# Altium schematic sheet project_buran.SchDoc
size A2; Author: A. Nikitin; Time: Project Buran Main Sheet
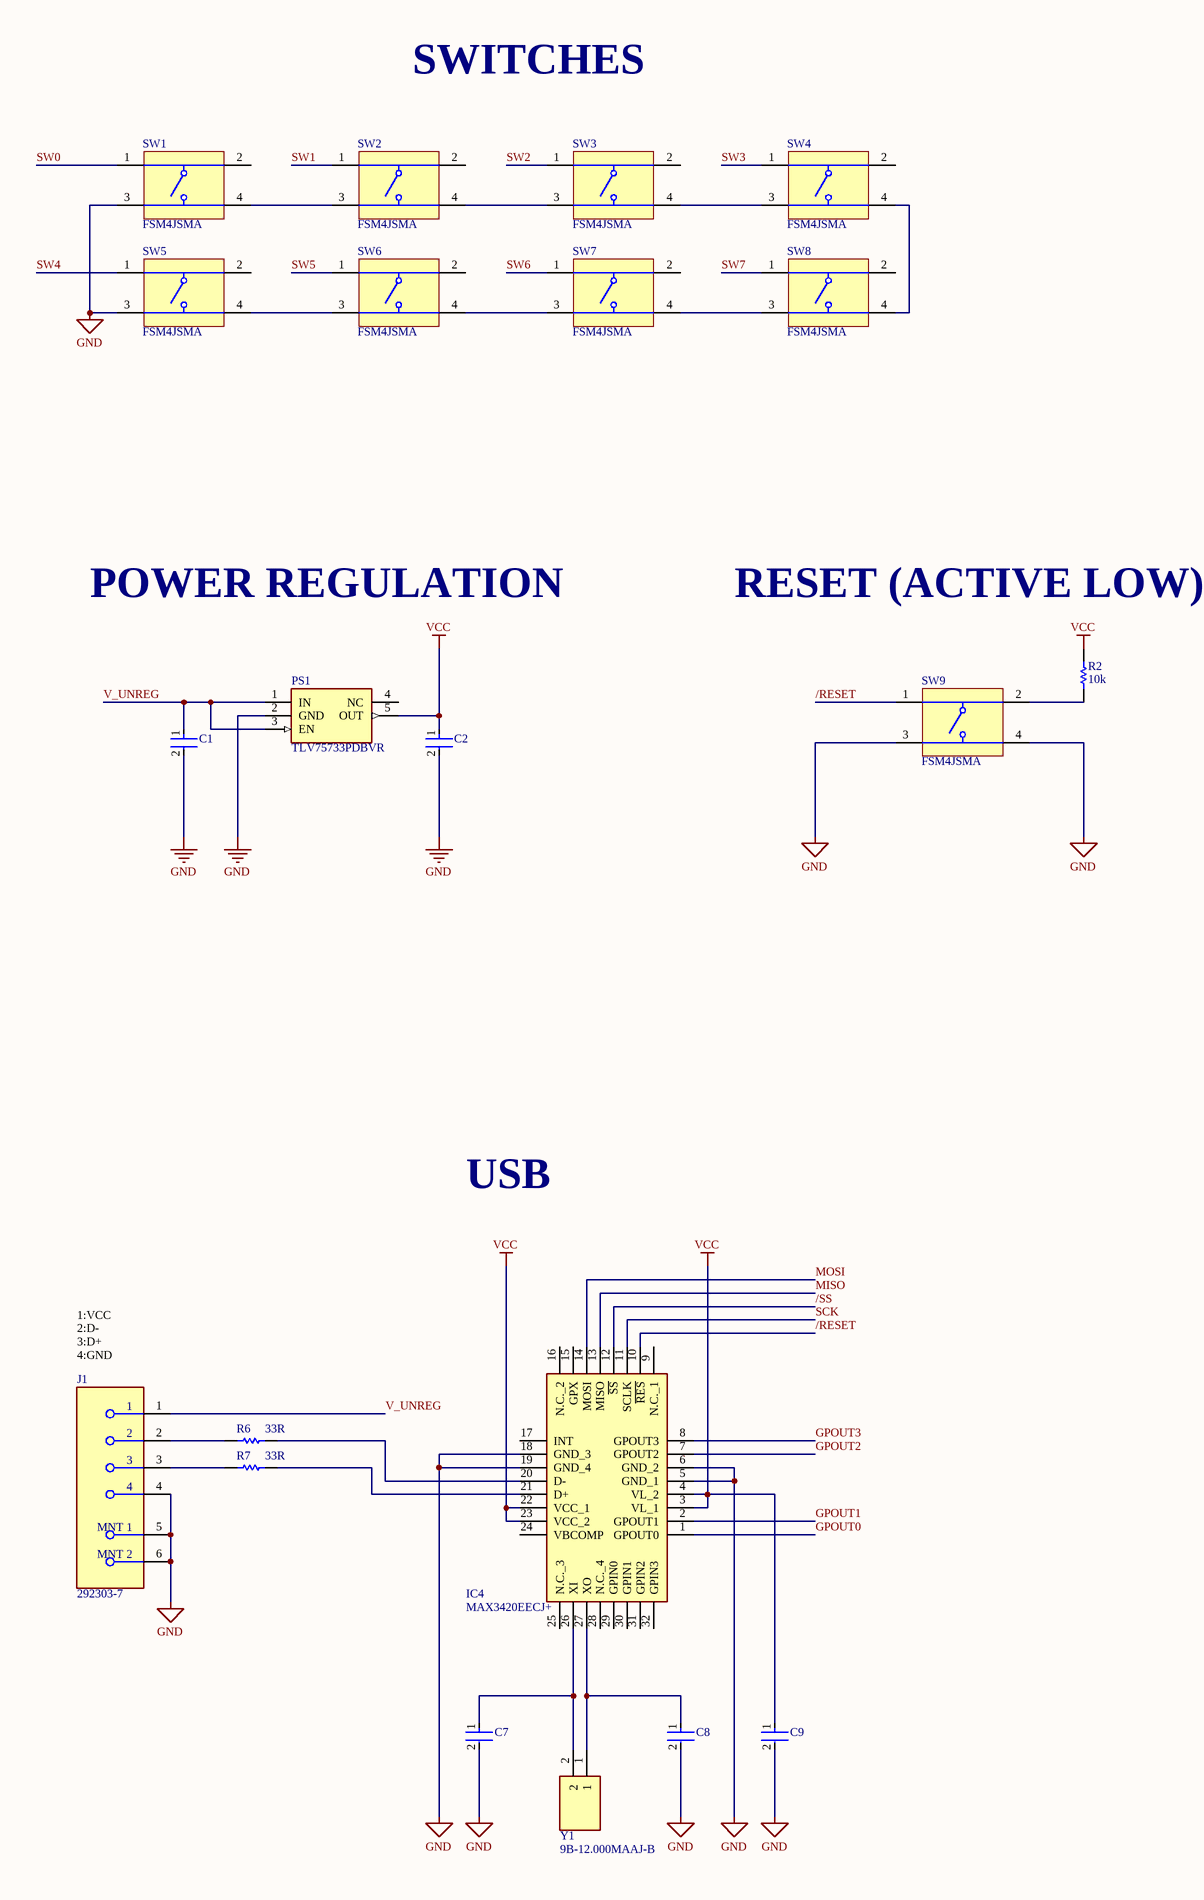
[diagram p0: project_buran.SchDoc, left]
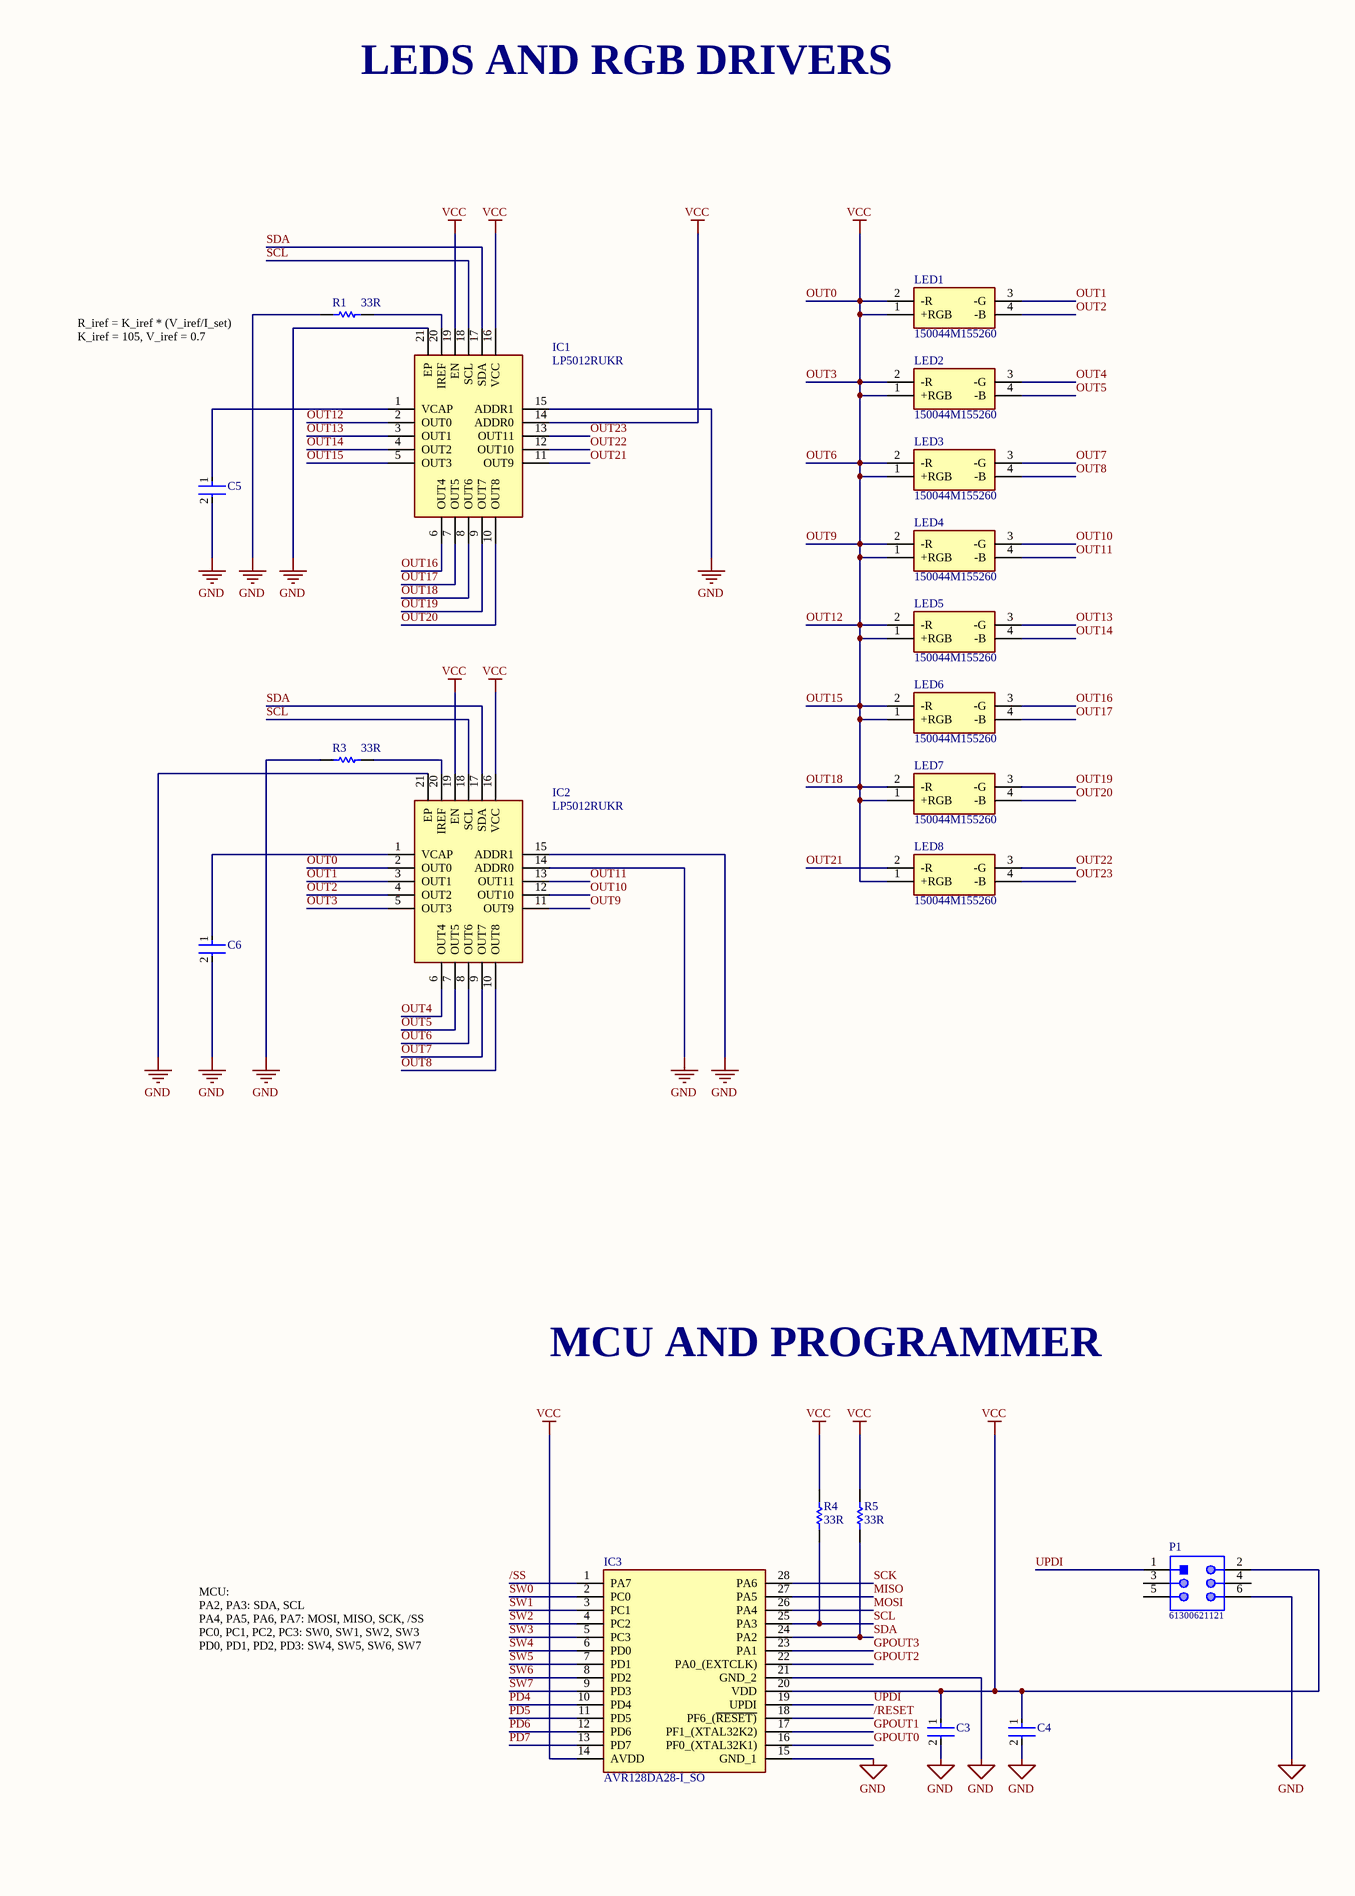
[diagram p1: project_buran.SchDoc, right]

## Parts
C1  GRM188R60J106ME47D  [FP-GRM188-0_1-e0_2_0_55-IPC_A]  (value not drawn)
C2  GRM188R60J106ME47D  [FP-GRM188-0_1-e0_2_0_55-IPC_A]  (value not drawn)
C3  GRM188R60J106ME47D  [FP-GRM188-0_1-e0_2_0_55-IPC_A]  (value not drawn)
C4  GRM188R60J106ME47D  [FP-GRM188-0_1-e0_2_0_55-IPC_A]  (value not drawn)
C5  GRM188R60J106ME47D  [FP-GRM188-0_1-e0_2_0_55-IPC_A]  (value not drawn)
C6  GRM188R60J106ME47D  [FP-GRM188-0_1-e0_2_0_55-IPC_A]  (value not drawn)
C7  GRM188R60J106ME47D  [FP-GRM188-0_1-e0_2_0_55-IPC_A]  (value not drawn)
C8  GRM188R60J106ME47D  [FP-GRM188-0_1-e0_2_0_55-IPC_A]  (value not drawn)
C9  GRM188R60J106ME47D  [FP-GRM188-0_1-e0_2_0_55-IPC_A]  (value not drawn)
IC1  LP5012RUKR  [QFN40P300X300X80-21N-D]
IC2  LP5012RUKR  [QFN40P300X300X80-21N-D]
IC3  AVR128DA28-I_SO  [SOIC127P1030X265-28N]
IC4  MAX3420EECJ+  [QFP80P900X900X160-32N]
J1  292303-7  [FP-292303-7-MFG]
LED1  150044M155260  [150044M155260]
LED2  150044M155260  [150044M155260]
LED3  150044M155260  [150044M155260]
LED4  150044M155260  [150044M155260]
LED5  150044M155260  [150044M155260]
LED6  150044M155260  [150044M155260]
LED7  150044M155260  [150044M155260]
LED8  150044M155260  [150044M155260]
P1  61300621121  [61300621121]
PS1  TLV75733PDBVR  [SOT95P280X145-5N]
R1  33R  [RESC1609X50X30NL10T20]
R2  10k  [RESC1609X50X30NL10T20]
R3  33R  [RESC1609X50X30NL10T20]
R4  33R  [RESC1609X50X30NL10T20]
R5  33R  [RESC1609X50X30NL10T20]
R6  33R  [RESC1609X50X30NL10T20]
R7  33R  [RESC1609X50X30NL10T20]
SW1  FSM4JSMA  [TECO-FSM4JSMA_V]
SW2  FSM4JSMA  [TECO-FSM4JSMA_V]
SW3  FSM4JSMA  [TECO-FSM4JSMA_V]
SW4  FSM4JSMA  [TECO-FSM4JSMA_V]
SW5  FSM4JSMA  [TECO-FSM4JSMA_V]
SW6  FSM4JSMA  [TECO-FSM4JSMA_V]
SW7  FSM4JSMA  [TECO-FSM4JSMA_V]
SW8  FSM4JSMA  [TECO-FSM4JSMA_V]
SW9  FSM4JSMA  [TECO-FSM4JSMA_V]
Y1  9B-12.000MAAJ-B  [9B12000MAAJB]

## Nets
GND: C1.2 C2.2 C3.2 C4.2 C5.2 C6.2 C7.2 C8.2 C9.2 IC1.15(ADDR1) IC1.21(EP) IC2.14(ADDR0) IC2.15(ADDR1) IC2.21(EP) IC3.15(GND_1) IC3.21(GND_2) IC4.5(GND_1) IC4.6(GND_2) IC4.18(GND_3) IC4.19(GND_4) J1.4 J1.5(MNT_1) J1.6(MNT_2) P1.6 PS1.2(GND) R1.1 R3.1 SW1.3 SW5.3 SW9.3 SW9.4
OUT0: C2.1 C3.1 C4.1 C9.1 IC1.2(OUT0) IC1.5(OUT3) IC1.8(OUT6) IC1.14(ADDR0) IC1.16(VCC) IC1.19(EN) IC2.2(OUT0) IC2.5(OUT3) IC2.8(OUT6) IC2.11(OUT9) IC2.16(VCC) IC2.19(EN) IC3.14(AVDD) IC3.20(VDD) IC4.3(VL_1) IC4.4(VL_2) IC4.22(VCC_1) IC4.23(VCC_2) LED1.1(+RGB) LED1.2(-R) LED2.1(+RGB) LED2.2(-R) LED3.1(+RGB) LED3.2(-R) LED4.1(+RGB) LED4.2(-R) LED5.1(+RGB) LED5.2(-R) LED6.1(+RGB) LED6.2(-R) LED7.1(+RGB) LED7.2(-R) LED8.1(+RGB) P1.2 PS1.5(OUT) R2.2 R4.2 R5.2  [also labelled OUT12, OUT15, OUT18, OUT3, OUT6, OUT9, VCC]
/RESET: IC3.18(PF6_(~{RESET)}) IC4.10(~{RES}) SW9.1
/SS: IC3.1(PA7) IC4.12(~{SS})
GPOUT0: IC3.16(PF0_(XTAL32K1)) IC4.1(GPOUT0)
GPOUT1: IC3.17(PF1_(XTAL32K2)) IC4.2(GPOUT1)
GPOUT2: IC3.22(PA0_(EXTCLK)) IC4.7(GPOUT2)
GPOUT3: IC3.23(PA1) IC4.8(GPOUT3)
MISO: IC3.27(PA5) IC4.13(MISO)
MOSI: IC3.26(PA4) IC4.14(MOSI)
OUT1: IC2.3(OUT1) LED1.3(-G)
OUT2: IC2.4(OUT2) LED1.4(-B)
OUT4: IC2.6(OUT4) LED2.3(-G)
OUT5: IC2.7(OUT5) LED2.4(-B)
OUT7: IC2.9(OUT7) LED3.3(-G)
OUT8: IC2.10(OUT8) LED3.4(-B)
OUT10: IC2.12(OUT10) LED4.3(-G)
OUT11: IC2.13(OUT11) LED4.4(-B)
OUT13: IC1.3(OUT1) LED5.3(-G)
OUT14: IC1.4(OUT2) LED5.4(-B)
OUT16: IC1.6(OUT4) LED6.3(-G)
OUT17: IC1.7(OUT5) LED6.4(-B)
OUT19: IC1.9(OUT7) LED7.3(-G)
OUT20: IC1.10(OUT8) LED7.4(-B)
OUT21: IC1.11(OUT9) LED8.2(-R)
OUT22: IC1.12(OUT10) LED8.3(-G)
OUT23: IC1.13(OUT11) LED8.4(-B)
PD4: IC3.10(PD4)
PD5: IC3.11(PD5)
PD6: IC3.12(PD6)
PD7: IC3.13(PD7)
SCK: IC3.28(PA6) IC4.11(SCLK)
SCL: IC1.18(SCL) IC2.18(SCL) IC3.25(PA3) R4.1
SDA: IC1.17(SDA) IC2.17(SDA) IC3.24(PA2) R5.1
SW0: IC3.2(PC0) SW1.1
SW1: IC3.3(PC1) SW2.1
SW2: IC3.4(PC2) SW3.1
SW3: IC3.5(PC3) SW4.1
SW4: IC3.6(PD0) SW5.1
SW5: IC3.7(PD1) SW6.1
SW6: IC3.8(PD2) SW7.1
SW7: IC3.9(PD3) SW8.1
UPDI: IC3.19(UPDI) P1.1
V_UNREG: C1.1 J1.1 PS1.1(IN) PS1.3(EN)
NetC5_1: C5.1 IC1.1(VCAP)
NetC6_1: C6.1 IC2.1(VCAP)
NetC7_1: C7.1 IC4.26(XI) Y1.2
NetC8_1: C8.1 IC4.27(XO) Y1.1
NetIC1_20: IC1.20(IREF) R1.2
NetIC2_20: IC2.20(IREF) R3.2
NetIC4_20: IC4.20(D-) R6.2
NetIC4_21: IC4.21(D+) R7.2
NetJ1_2: J1.2 R6.1
NetJ1_3: J1.3 R7.1
NetR2_1: R2.1 SW9.2
NetSW1_4: SW1.4 SW2.3
NetSW2_4: SW2.4 SW3.3
NetSW3_4: SW3.4 SW4.3
NetSW4_4: SW4.4 SW8.4
NetSW5_4: SW5.4 SW6.3
NetSW6_4: SW6.4 SW7.3
NetSW7_4: SW7.4 SW8.3

Not connected (* = marked no-connect by the designer): IC4 9(N.C._1) 15(GPX) 16(N.C._2) 17(INT) 24(VBCOMP) 25(N.C._3) 28(N.C._4) 29(GPIN0) 30(GPIN1) 31(GPIN2) 32(GPIN3); P1 3 4 5; PS1 4(NC); SW1 2; SW2 2; SW3 2; SW4 2; SW5 2; SW6 2; SW7 2; SW8 2

## Notes on the sheet
- SWITCHES
- LEDS AND RGB DRIVERS
- R_iref = K_iref * (V_iref/I_set)
  K_iref = 105, V_iref = 0.7
- POWER REGULATION
- RESET (ACTIVE LOW)
- USB
- (near J1) 1:VCC
  2:D-
  3:D+
  4:GND
- MCU AND PROGRAMMER
- MCU:
  PA2, PA3: SDA, SCL
  PA4, PA5, PA6, PA7: MOSI, MISO, SCK, /SS
  PC0, PC1, PC2, PC3: SW0, SW1, SW2, SW3
  PD0, PD1, PD2, PD3: SW4, SW5, SW6, SW7
- Title
- Size:
- Date:
- File:
- A2
- Number:
- Time:
- Revision:
- Sheet
- of

## Library data of the parts
C1-C9 = CMP-2006-02792-2: Chip Multilayer Ceramic Capacitors for General Purpose, 0603, 10uF, X5R, 15%, 20%, 6.3V; Packaging: Tape and Reel; Voltage Rating (DC): 6.3V; Width: 0.031inch; Termination: SMD/SMT; Dielectric: X5R; Package Quantity: 4000; Voltage Rating: 6.3V; Capacitance: 10uF; Case/Package: 0603; Min Operating Temperature: -55°C; Voltage: 6.3V; Length: 1.6mm; Thickness: 0.035inch; Lead Free: Lead Free; Depth: 0.8mm; Case Code (Imperial): 0603; Max Operating Temperature: 85°C; Material: Ceramic; Height: 0.8mm; Tolerance: 20%; Mount: Surface Mount; REACH SVHC: No SVHC; Radiation Hardening: No; Case Code (Metric): 1608
IC1 IC2 = LP5012RUKR: Integrated Circuit; Manufacturer_Name: Texas Instruments; Datasheet Link: http://www.ti.com/lit/gpn/LP5012; Height: 0.8mm; Manufacturer_Part_Number: LP5012RUKR; Mouser Part Number: 595-LP5012RUKR; Mouser Price/Stock: https://www.mouser.co.uk/ProductDetail/Texas-Instruments/LP5012RUKR?qs=mAH9sUMRCts7Z0PlkfxWfA%3D%3D; Arrow Part Number: LP5012RUKR; Arrow Price/Stock: https://www.arrow.com/en/products/lp5012rukr/texas-instruments
IC3 = AVR128DA28-I_SO: Integrated Circuit; Manufacturer_Name: Microchip; Manufacturer_Part_Number: AVR128DA28-I/SO; Datasheet Link: https://componentsearchengine.com/Datasheets/2/AVR128DA28-I_SO.pdf; Height: 2.65mm; Mouser Part Number: 579-AVR128DA28-I/SO; Mouser Price/Stock: https://www.mouser.co.uk/ProductDetail/Microchip-Technology/AVR128DA28-I-SO?qs=xZ%2FP%252Ba9zWqZ3NQP19LtSGg%3D%3D; Arrow Part Number: AVR128DA28-I/SO; Arrow Price/Stock: https://www.arrow.com/en/products/avr128da28-iso/microchip-technology
IC4 = MAX3420EECJ+: Integrated Circuit; Manufacturer_Name: Maxim Integrated; Datasheet Link: https://pdfserv.maximintegrated.com/en/ds/MAX3420E.pdf; Height: 1.6mm; Manufacturer_Part_Number: MAX3420EECJ+; Mouser Part Number: 700-MAX3420EECJ; Mouser Price/Stock: https://www.mouser.co.uk/ProductDetail/Maxim-Integrated/MAX3420EECJ%2b?qs=1THa7WoU59F45gydMDQ7mg%3D%3D
J1 = CMP-03360-000008-1: CONN RCPT USB2.0 TYPEA 4P SMD RA; Manufacturer: TE Connectivity; Is Female: yes; Current Rating: 1A; Number Of Contacts: 4; Voltage Rating: 30V; Conn Orientation: Right Angle; Shielding: true; Digikey Description: CONN RCPT USB2.0 TYPEA 4P SMD RA; Manufacturer Part Number: 292303-7; Automotive: No; Category: Conn; Temperature: -55°C to +85°C; ComponentLink2Description: Datasheet; Mouser Description: USB Connectors USB A R/A Recpt Assy SMT; Contact Material: Gold,Nickel; Package: 292303-7; Device Class L3: unset; Octopart: https://octopart.com/292303-7-te+connectivity-42840369; RoHS: TRUE; Device Class L2: USB Connectors; ComponentLink2URL: https://www.te.com/usa-en/product-292303-7.html?te_bu=Cor&te_type=other&te_campaign=oct_glo_cor-oct-global-oth-prtnr-fy19-oct-octo-buy-bom_sma-298_2&elqCampaignId=35216; Temperature Range Low: -55°C; Usb Standard: USB 2.0; Temperature Range High: +85°C; Lead Free: Yes; Device Class L1: Connectors
LED1-LED8 = 150044M155260: LED; Manufacturer_Name: Wurth Elektronik; Datasheet Link: https://www.we-online.com/catalog/datasheet/150044M155260.pdf; Height: 0.75mm; Manufacturer_Part_Number: 150044M155260; Mouser Part Number: 710-150044M155260; Mouser Price/Stock: https://www.mouser.co.uk/ProductDetail/Wurth-Elektronik/150044M155260?qs=u16ybLDytRba39Og9E2ywA%3D%3D
P1 = CMP-1502-01072-1: THT Vertical Pin Header WR-PHD, Pitch 2.54 mm, Dual Row, 6 pins; Manufacturer: Wurth Elektronik; Contact Resistance: 20mOhm; Withstanding Voltage: 500VAC; Pin Number: 6; Gender: Male; Pitch: 2.54mm; Working Voltage: 250VAC; Rated Current: 3A; Packaging: Bag; Row Number: Dual; Manufacturer URL: http://www.we-online.de; Part Number: 61300621121; Operating Temperature: -40to105degC; Mounting Technology: THT; Package Reference: 61300621121; Datasheet URL: https://katalog.we-online.de/em/datasheet/6130xx21121.pdf; Orientation: Vertical; Publisher: WurthElektronik
PS1 = TLV75733PDBVR: Power Supply; Manufacturer_Name: Texas Instruments; Datasheet Link: http://www.ti.com/lit/gpn/tlv757p; Height: 1.45mm; Manufacturer_Part_Number: TLV75733PDBVR; Mouser Part Number: 595-TLV75733PDBVR; Mouser Price/Stock: https://www.mouser.co.uk/ProductDetail/Texas-Instruments/TLV75733PDBVR?qs=y6ZabgHbY%252BwAAzSntTW34w%3D%3D; Arrow Part Number: TLV75733PDBVR; Arrow Price/Stock: https://www.arrow.com/en/products/tlv75733pdbvr/texas-instruments
R1-R7 = CMP-2000-03854-1: Part Number: CRCW0603110RFKEA; Manufacturer: Vishay Dale
SW1-SW9 = CMP-2000-05602-2: Swicth, SPST, 24 V, -35 to 85 degC, 4-Pin SMD, RoHS, Tape and Reel; Manufacturer: TE Connectivity; Switch Travel: 0.25mm; Mechanical Life: 100000Cycles; Contact Current Rating: 50mA; Operating Force: 1.57N; Actuator Material: Polyamide; Contact Resistance: 100mOhm; Voltage Rating: 24V; Illumination Type: Illuminated; Actuator Length: 0.055inch; Max Voltage Rating (DC): 12V; Case\/Package: SMD/SMT; Orientation: Straight; Datasheet URL: http://www.te.com/commerce/DocumentDelivery/DDEController?Action=showdoc&DocId=Customer+Drawing%7F2-1437565-7%7FV%7Fpdf%7FEnglish%7FENG_CD_2-1437565-7_V.pdf%7F4-1437565-2; Min Operating Temperature: -35degC; Packaging: LoosePiece; Termination: GullWing; Throw Configuration: SPST; Package Description: 4-Pin Surface Mount Device, Body 6 x 6 mm, Pitch 4.5 mm; Mounting Technology: SurfaceMount; Contact Plating: Silver; Datasheet Version: Rev. V, 02/2015; RoHSCompliant: true; Max Operating Temperature: 85degC; Length: 6mm; Voltage Rating (DC): 24V; Electrical Life: 100000Cycles; Current Rating: 50mA; Package Quantity: 750; Mount: SurfaceMount; Package Reference: FSM4JSMA; Manufacturer URL: http://www.te.com/; Width: 6mm; REACH SVHC: Unknown; Contact Material: CopperAlloy
Y1 = 9B-12.000MAAJ-B: Crystal or Oscillator; Manufacturer_Name: TXC; Datasheet Link: https://componentsearchengine.com/Datasheets/2/9B-12.000MAAJ-B.pdf; Height: 3.68mm; Manufacturer_Part_Number: 9B-12.000MAAJ-B; Mouser Part Number: 717-9B-12.000MAAJ-B; Mouser Price/Stock: https://www.mouser.co.uk/ProductDetail/TXC-Corporation/9B-12000MAAJ-B?qs=65dIHZNch5trLKZkRFdipQ%3D%3D